# EAGLE board Glasses (EAGLE 9.1.0)
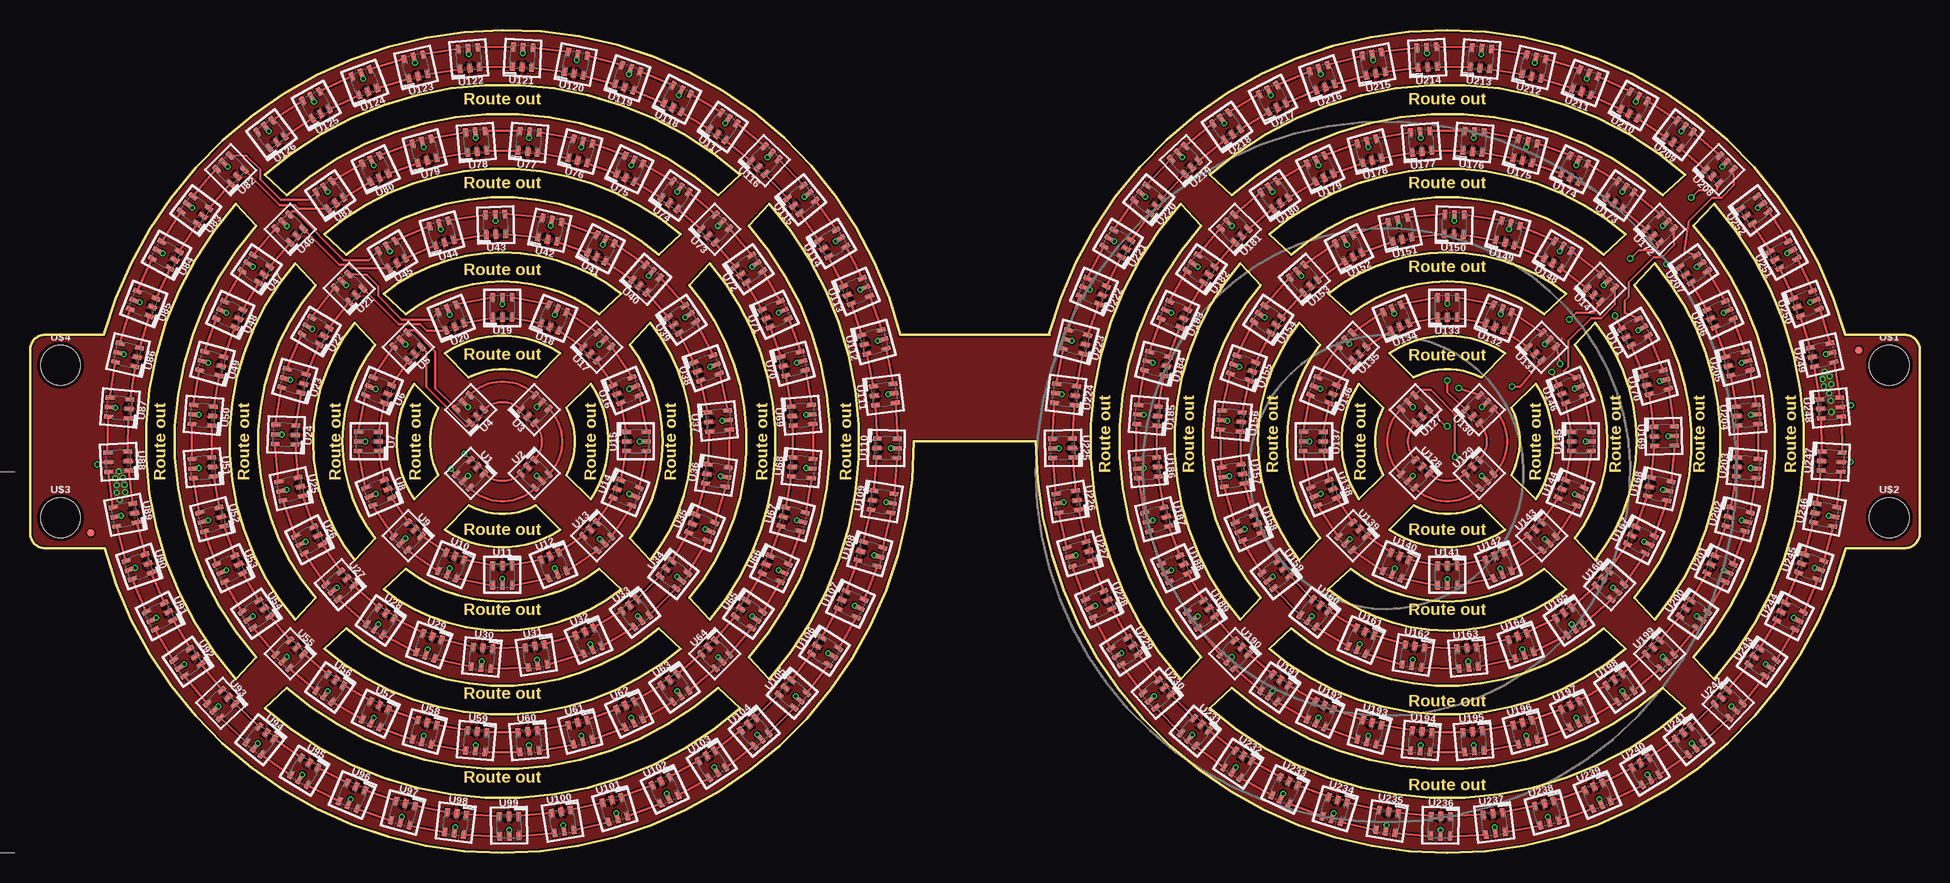
[diagram p9: board, top side]
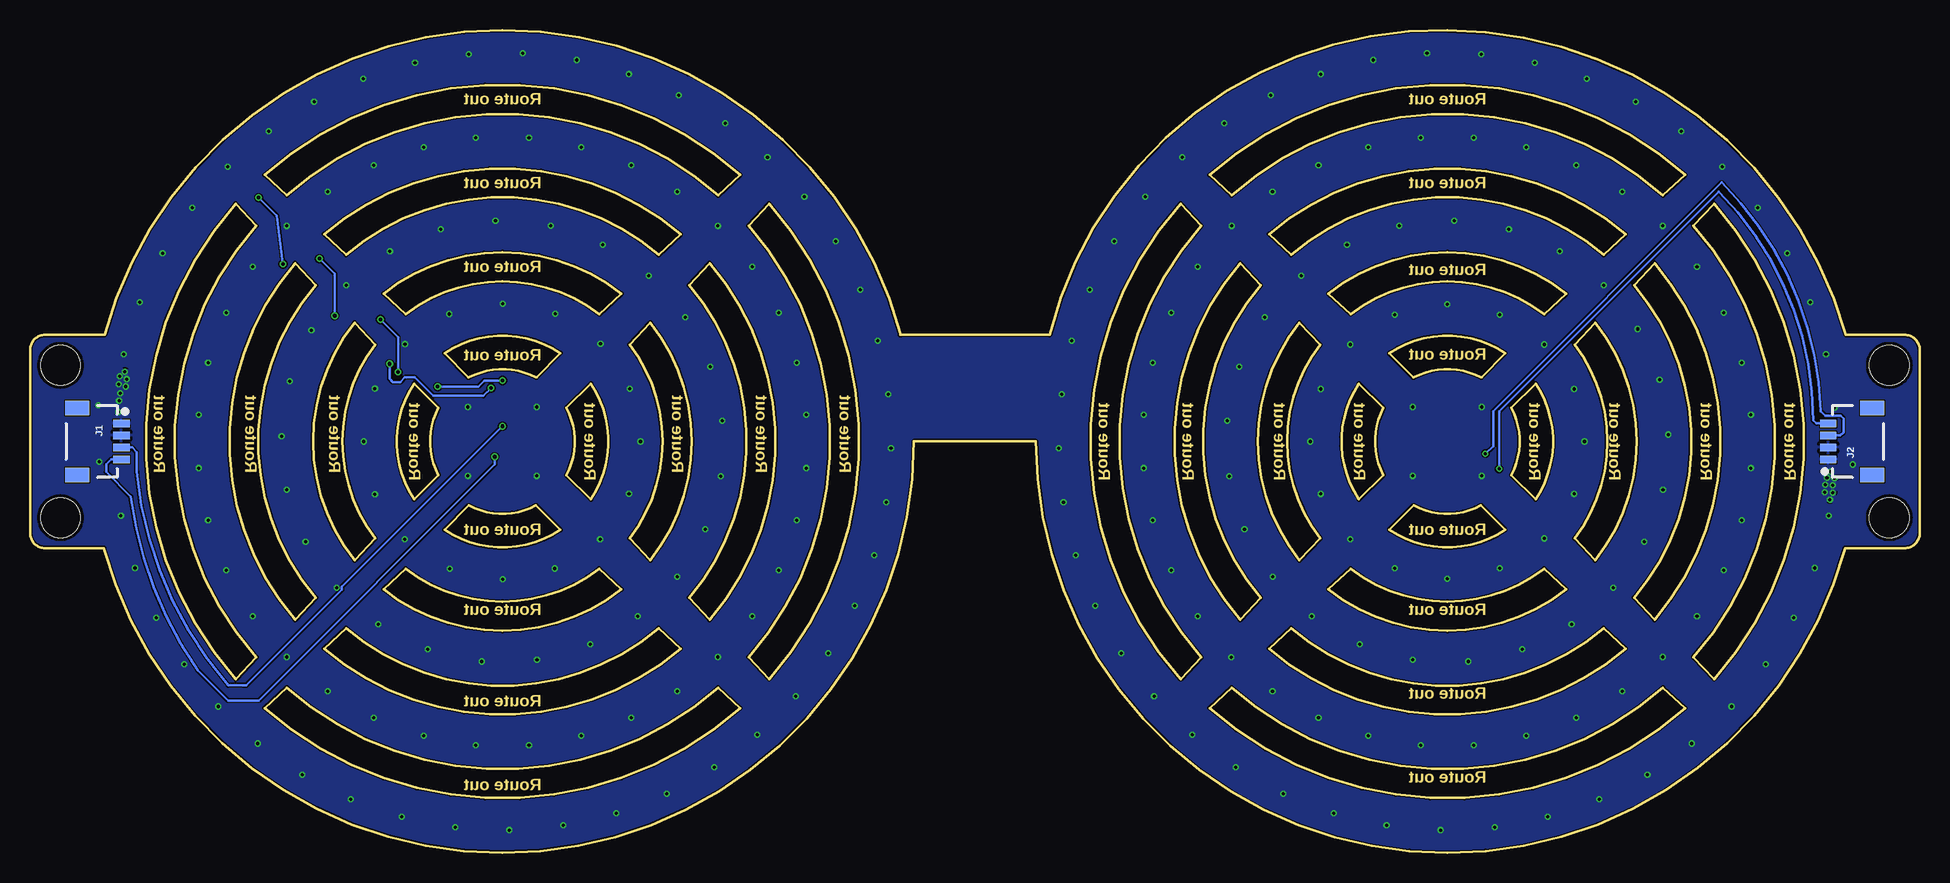
[diagram p10: board, bottom side, seen from below]

Size 157.48 x 68.58 mm. Coordinates in mm from the lower left corner, seen from the top.
Outline: 153 segments
Copper layers (1*16): Top 0.035mm / dielectric 1.5mm / Bottom 0.035mm
Design rules "SparkFun-2-layer-FAB-LIMIT": minimum track width 4mil, minimum drill 6mil, track to track 4mil, track to pad 4mil, pad to pad 4mil, via to via 4mil, smd to smd 4mil, copper to edge 4mil, drill to drill 4mil, minimum pad ring 5mil, minimum via ring 5mil, stop-mask expansion 4mil, vias tented up to drill 25mil, thermal gap 10mil

## Footprints (pad centres in the part's own frame; a part is rotated, then mirrored left to right if it is on the bottom)
FIDUCIAL-MICRO = smd 0.635 x 0.635: 1 0,0
1X04_1MM_RA = smd 0.6 x 1.35: 1 -1.5,0; 2 -0.5,0; 3 0.5,0; 4 1.5,0 | smd 1.2 x 2: NC1 2.8,-3.675; NC2 -2.8,-3.675
APA102-2020 = smd 0.4 x 0.7: CKI -0.8,-0.85; CKO 0.8,-0.85; GND 0,0.85; SDI -0.8,0.85; SDO 0.8,0.85; VDD 0,-0.85
STAND-OFF = hole 3.302: 0,0

## Placement (x,y rotation side)
FD1  FIDUCIALUFIDUCIAL  [FIDUCIAL-MICRO]  152.4,41.91 0 top
FD2  FIDUCIALUFIDUCIAL  [FIDUCIAL-MICRO]  5.08,26.67 0 top
J1  [1X04_1MM_RA]  149.86,34.29 270 bottom
J2  [1X04_1MM_RA]  7.62,34.29 90 bottom
U1  APA102-2020  [APA102-2020]  36.68,31.6 315 top
U2  APA102-2020  [APA102-2020]  42.06,31.6 45 top
U3  APA102-2020  [APA102-2020]  42.06,36.98 135 top
U4  APA102-2020  [APA102-2020]  36.68,36.98 225 top
U5  APA102-2020  [APA102-2020]  31.47,42.19 225 top
U6  APA102-2020  [APA102-2020]  29.04,38.57 247.5 top
U7  APA102-2020  [APA102-2020]  28.19,34.29 270 top
U8  APA102-2020  [APA102-2020]  29.04,30.01 292.5 top
U9  APA102-2020  [APA102-2020]  31.47,26.39 315 top
U10  APA102-2020  [APA102-2020]  35.09,23.96 337.5 top
U11  APA102-2020  [APA102-2020]  39.37,23.11 0 top
U12  APA102-2020  [APA102-2020]  43.65,23.96 22.5 top
U13  APA102-2020  [APA102-2020]  47.27,26.39 45 top
U14  APA102-2020  [APA102-2020]  49.7,30.01 67.5 top
U15  APA102-2020  [APA102-2020]  50.55,34.29 90 top
U16  APA102-2020  [APA102-2020]  49.7,38.57 112.5 top
U17  APA102-2020  [APA102-2020]  47.27,42.19 135 top
U18  APA102-2020  [APA102-2020]  43.65,44.62 157.5 top
U19  APA102-2020  [APA102-2020]  39.37,45.47 180 top
U20  APA102-2020  [APA102-2020]  35.09,44.62 202.5 top
U21  APA102-2020  [APA102-2020]  26.57,47.09 225 top
U22  APA102-2020  [APA102-2020]  23.79,43.5 239.4 top
U23  APA102-2020  [APA102-2020]  21.99,39.34 253.8 top
U24  APA102-2020  [APA102-2020]  21.28,34.86 268.2 top
U25  APA102-2020  [APA102-2020]  21.71,30.34 282.6 top
U26  APA102-2020  [APA102-2020]  23.25,26.07 297 top
U27  APA102-2020  [APA102-2020]  25.79,22.32 311.4 top
U28  APA102-2020  [APA102-2020]  29.2,19.32 325.8 top
U29  APA102-2020  [APA102-2020]  33.24,17.26 340.2 top
U30  APA102-2020  [APA102-2020]  37.67,16.27 354.6 top
U31  APA102-2020  [APA102-2020]  42.2,16.42 9 top
U32  APA102-2020  [APA102-2020]  46.56,17.68 23.4 top
U33  APA102-2020  [APA102-2020]  50.46,19.99 37.8 top
U34  APA102-2020  [APA102-2020]  53.67,23.2 52.2 top
U35  APA102-2020  [APA102-2020]  55.98,27.1 66.6 top
U36  APA102-2020  [APA102-2020]  57.24,31.46 81 top
U37  APA102-2020  [APA102-2020]  57.39,35.99 95.4 top
U38  APA102-2020  [APA102-2020]  56.4,40.42 109.8 top
U39  APA102-2020  [APA102-2020]  54.34,44.46 124.2 top
U40  APA102-2020  [APA102-2020]  51.34,47.87 138.6 top
U41  APA102-2020  [APA102-2020]  47.59,50.41 153 top
U42  APA102-2020  [APA102-2020]  43.32,51.95 167.4 top
U43  APA102-2020  [APA102-2020]  38.8,52.38 181.8 top
U44  APA102-2020  [APA102-2020]  34.32,51.67 196.2 top
U45  APA102-2020  [APA102-2020]  30.16,49.87 210.6 top
U46  APA102-2020  [APA102-2020]  21.63,52.03 225 top
U47  APA102-2020  [APA102-2020]  18.82,48.68 235 top
U48  APA102-2020  [APA102-2020]  16.64,44.89 245 top
U49  APA102-2020  [APA102-2020]  15.14,40.78 255 top
U50  APA102-2020  [APA102-2020]  14.38,36.48 265 top
U51  APA102-2020  [APA102-2020]  14.38,32.1 275 top
U52  APA102-2020  [APA102-2020]  15.14,27.8 285 top
U53  APA102-2020  [APA102-2020]  16.64,23.69 295 top
U54  APA102-2020  [APA102-2020]  18.82,19.9 305 top
U55  APA102-2020  [APA102-2020]  21.63,16.55 315 top
U56  APA102-2020  [APA102-2020]  24.98,13.74 325 top
U57  APA102-2020  [APA102-2020]  28.77,11.56 335 top
U58  APA102-2020  [APA102-2020]  32.88,10.06 345 top
U59  APA102-2020  [APA102-2020]  37.18,9.3 355 top
U60  APA102-2020  [APA102-2020]  41.56,9.3 5 top
U61  APA102-2020  [APA102-2020]  45.86,10.06 15 top
U62  APA102-2020  [APA102-2020]  49.97,11.56 25 top
U63  APA102-2020  [APA102-2020]  53.76,13.74 35 top
U64  APA102-2020  [APA102-2020]  57.11,16.55 45 top
U65  APA102-2020  [APA102-2020]  59.92,19.9 55 top
U66  APA102-2020  [APA102-2020]  62.1,23.69 65 top
U67  APA102-2020  [APA102-2020]  63.6,27.8 75 top
U68  APA102-2020  [APA102-2020]  64.36,32.1 85 top
U69  APA102-2020  [APA102-2020]  64.36,36.48 95 top
U70  APA102-2020  [APA102-2020]  63.6,40.78 105 top
U71  APA102-2020  [APA102-2020]  62.1,44.89 115 top
U72  APA102-2020  [APA102-2020]  59.92,48.68 125 top
U73  APA102-2020  [APA102-2020]  57.11,52.03 135 top
U74  APA102-2020  [APA102-2020]  53.76,54.84 145 top
U75  APA102-2020  [APA102-2020]  49.97,57.02 155 top
U76  APA102-2020  [APA102-2020]  45.86,58.52 165 top
U77  APA102-2020  [APA102-2020]  41.56,59.28 175 top
U78  APA102-2020  [APA102-2020]  37.18,59.28 185 top
U79  APA102-2020  [APA102-2020]  32.88,58.52 195 top
U80  APA102-2020  [APA102-2020]  28.77,57.02 205 top
U81  APA102-2020  [APA102-2020]  24.98,54.84 215 top
U82  APA102-2020  [APA102-2020]  16.69,56.97 225 top
U83  APA102-2020  [APA102-2020]  13.76,53.59 233 top
U84  APA102-2020  [APA102-2020]  11.32,49.84 241 top
U85  APA102-2020  [APA102-2020]  9.43,45.78 249 top
U86  APA102-2020  [APA102-2020]  8.12,41.5 257 top
U87  APA102-2020  [APA102-2020]  7.42,37.08 265 top
U88  APA102-2020  [APA102-2020]  7.35,32.61 273 top
U89  APA102-2020  [APA102-2020]  7.89,28.17 281 top
U90  APA102-2020  [APA102-2020]  9.05,23.85 289 top
U91  APA102-2020  [APA102-2020]  10.8,19.73 297 top
U92  APA102-2020  [APA102-2020]  13.1,15.9 305 top
U93  APA102-2020  [APA102-2020]  15.92,12.42 313 top
U94  APA102-2020  [APA102-2020]  19.19,9.37 321 top
U95  APA102-2020  [APA102-2020]  22.85,6.8 329 top
U96  APA102-2020  [APA102-2020]  26.84,4.77 337 top
U97  APA102-2020  [APA102-2020]  31.07,3.32 345 top
U98  APA102-2020  [APA102-2020]  35.46,2.46 353 top
U99  APA102-2020  [APA102-2020]  39.93,2.23 1 top
U100  APA102-2020  [APA102-2020]  44.39,2.62 9 top
U101  APA102-2020  [APA102-2020]  48.75,3.62 17 top
U102  APA102-2020  [APA102-2020]  52.92,5.23 25 top
U103  APA102-2020  [APA102-2020]  56.84,7.4 33 top
U104  APA102-2020  [APA102-2020]  60.41,10.09 41 top
U105  APA102-2020  [APA102-2020]  63.57,13.25 49 top
U106  APA102-2020  [APA102-2020]  66.26,16.82 57 top
U107  APA102-2020  [APA102-2020]  68.43,20.74 65 top
U108  APA102-2020  [APA102-2020]  70.04,24.91 73 top
U109  APA102-2020  [APA102-2020]  71.04,29.27 81 top
U110  APA102-2020  [APA102-2020]  71.43,33.73 89 top
U111  APA102-2020  [APA102-2020]  71.2,38.2 97 top
U112  APA102-2020  [APA102-2020]  70.34,42.59 105 top
U113  APA102-2020  [APA102-2020]  68.89,46.82 113 top
U114  APA102-2020  [APA102-2020]  66.86,50.81 121 top
U115  APA102-2020  [APA102-2020]  64.29,54.47 129 top
U116  APA102-2020  [APA102-2020]  61.24,57.74 137 top
U117  APA102-2020  [APA102-2020]  57.76,60.56 145 top
U118  APA102-2020  [APA102-2020]  53.93,62.86 153 top
U119  APA102-2020  [APA102-2020]  49.81,64.61 161 top
U120  APA102-2020  [APA102-2020]  45.49,65.77 169 top
U121  APA102-2020  [APA102-2020]  41.05,66.31 177 top
U122  APA102-2020  [APA102-2020]  36.58,66.24 185 top
U123  APA102-2020  [APA102-2020]  32.16,65.54 193 top
U124  APA102-2020  [APA102-2020]  27.88,64.23 201 top
U125  APA102-2020  [APA102-2020]  23.82,62.34 209 top
U126  APA102-2020  [APA102-2020]  20.07,59.9 217 top
U127  APA102-2020  [APA102-2020]  115.42,36.98 225 top
U128  APA102-2020  [APA102-2020]  115.42,31.6 315 top
U129  APA102-2020  [APA102-2020]  120.8,31.6 45 top
U130  APA102-2020  [APA102-2020]  120.8,36.98 135 top
U131  APA102-2020  [APA102-2020]  126.01,42.19 135 top
U132  APA102-2020  [APA102-2020]  122.39,44.62 157.5 top
U133  APA102-2020  [APA102-2020]  118.11,45.47 180 top
U134  APA102-2020  [APA102-2020]  113.83,44.62 202.5 top
U135  APA102-2020  [APA102-2020]  110.21,42.19 225 top
U136  APA102-2020  [APA102-2020]  107.78,38.57 247.5 top
U137  APA102-2020  [APA102-2020]  106.93,34.29 270 top
U138  APA102-2020  [APA102-2020]  107.78,30.01 292.5 top
U139  APA102-2020  [APA102-2020]  110.21,26.39 315 top
U140  APA102-2020  [APA102-2020]  113.83,23.96 337.5 top
U141  APA102-2020  [APA102-2020]  118.11,23.11 0 top
U142  APA102-2020  [APA102-2020]  122.39,23.96 22.5 top
U143  APA102-2020  [APA102-2020]  126.01,26.39 45 top
U144  APA102-2020  [APA102-2020]  128.44,30.01 67.5 top
U145  APA102-2020  [APA102-2020]  129.29,34.29 90 top
U146  APA102-2020  [APA102-2020]  128.44,38.57 112.5 top
U147  APA102-2020  [APA102-2020]  130.91,47.09 135 top
U148  APA102-2020  [APA102-2020]  127.32,49.87 149.4 top
U149  APA102-2020  [APA102-2020]  123.16,51.67 163.8 top
U150  APA102-2020  [APA102-2020]  118.68,52.38 178.2 top
U151  APA102-2020  [APA102-2020]  114.16,51.95 192.6 top
U152  APA102-2020  [APA102-2020]  109.89,50.41 207 top
U153  APA102-2020  [APA102-2020]  106.14,47.87 221.4 top
U154  APA102-2020  [APA102-2020]  103.14,44.46 235.8 top
U155  APA102-2020  [APA102-2020]  101.08,40.42 250.2 top
U156  APA102-2020  [APA102-2020]  100.09,35.99 264.6 top
U157  APA102-2020  [APA102-2020]  100.24,31.46 279 top
U158  APA102-2020  [APA102-2020]  101.5,27.1 293.4 top
U159  APA102-2020  [APA102-2020]  103.81,23.2 307.8 top
U160  APA102-2020  [APA102-2020]  107.02,19.99 322.2 top
U161  APA102-2020  [APA102-2020]  110.92,17.68 336.6 top
U162  APA102-2020  [APA102-2020]  115.28,16.42 351 top
U163  APA102-2020  [APA102-2020]  119.81,16.27 5.4 top
U164  APA102-2020  [APA102-2020]  124.24,17.26 19.8 top
U165  APA102-2020  [APA102-2020]  128.28,19.32 34.2 top
U166  APA102-2020  [APA102-2020]  131.69,22.32 48.6 top
U167  APA102-2020  [APA102-2020]  134.23,26.07 63 top
U168  APA102-2020  [APA102-2020]  135.77,30.34 77.4 top
U169  APA102-2020  [APA102-2020]  136.2,34.73 91.4 top
U170  APA102-2020  [APA102-2020]  135.52,39.22 105.8 top
U171  APA102-2020  [APA102-2020]  133.75,43.39 120.2 top
U172  APA102-2020  [APA102-2020]  135.85,52.03 135 top
U173  APA102-2020  [APA102-2020]  132.5,54.84 145 top
U174  APA102-2020  [APA102-2020]  128.71,57.02 155 top
U175  APA102-2020  [APA102-2020]  124.6,58.52 165 top
U176  APA102-2020  [APA102-2020]  120.3,59.28 175 top
U177  APA102-2020  [APA102-2020]  115.92,59.28 185 top
U178  APA102-2020  [APA102-2020]  111.62,58.52 195 top
U179  APA102-2020  [APA102-2020]  107.51,57.02 205 top
U180  APA102-2020  [APA102-2020]  103.72,54.84 215 top
U181  APA102-2020  [APA102-2020]  100.37,52.03 225 top
U182  APA102-2020  [APA102-2020]  97.56,48.68 235 top
U183  APA102-2020  [APA102-2020]  95.38,44.89 245 top
U184  APA102-2020  [APA102-2020]  93.88,40.78 255 top
U185  APA102-2020  [APA102-2020]  93.12,36.48 265 top
U186  APA102-2020  [APA102-2020]  93.12,32.1 275 top
U187  APA102-2020  [APA102-2020]  93.88,27.8 285 top
U188  APA102-2020  [APA102-2020]  95.38,23.69 295 top
U189  APA102-2020  [APA102-2020]  97.56,19.9 305 top
U190  APA102-2020  [APA102-2020]  100.37,16.55 315 top
U191  APA102-2020  [APA102-2020]  103.72,13.74 325 top
U192  APA102-2020  [APA102-2020]  107.51,11.56 335 top
U193  APA102-2020  [APA102-2020]  111.62,10.06 345 top
U194  APA102-2020  [APA102-2020]  115.92,9.3 355 top
U195  APA102-2020  [APA102-2020]  120.3,9.3 5 top
U196  APA102-2020  [APA102-2020]  124.6,10.06 15 top
U197  APA102-2020  [APA102-2020]  128.71,11.56 25 top
U198  APA102-2020  [APA102-2020]  132.5,13.74 35 top
U199  APA102-2020  [APA102-2020]  135.85,16.55 45 top
U200  APA102-2020  [APA102-2020]  138.66,19.9 55 top
U201  APA102-2020  [APA102-2020]  140.84,23.69 65 top
U202  APA102-2020  [APA102-2020]  142.34,27.8 75 top
U203  APA102-2020  [APA102-2020]  143.1,32.1 85 top
U204  APA102-2020  [APA102-2020]  143.1,36.48 95 top
U205  APA102-2020  [APA102-2020]  142.34,40.78 105 top
U206  APA102-2020  [APA102-2020]  140.84,44.89 115 top
U207  APA102-2020  [APA102-2020]  138.66,48.68 125 top
U208  APA102-2020  [APA102-2020]  140.79,56.97 135 top
U209  APA102-2020  [APA102-2020]  137.41,59.9 143 top
U210  APA102-2020  [APA102-2020]  133.66,62.34 151 top
U211  APA102-2020  [APA102-2020]  129.6,64.23 159 top
U212  APA102-2020  [APA102-2020]  125.32,65.54 167 top
U213  APA102-2020  [APA102-2020]  120.9,66.24 175 top
U214  APA102-2020  [APA102-2020]  116.43,66.31 183 top
U215  APA102-2020  [APA102-2020]  111.99,65.77 191 top
U216  APA102-2020  [APA102-2020]  107.67,64.61 199 top
U217  APA102-2020  [APA102-2020]  103.55,62.86 207 top
U218  APA102-2020  [APA102-2020]  99.72,60.56 215 top
U219  APA102-2020  [APA102-2020]  96.24,57.74 223 top
U220  APA102-2020  [APA102-2020]  93.19,54.47 231 top
U221  APA102-2020  [APA102-2020]  90.62,50.81 239 top
U222  APA102-2020  [APA102-2020]  88.59,46.82 247 top
U223  APA102-2020  [APA102-2020]  87.14,42.59 255 top
U224  APA102-2020  [APA102-2020]  86.28,38.2 263 top
U225  APA102-2020  [APA102-2020]  86.05,33.73 271 top
U226  APA102-2020  [APA102-2020]  86.44,29.27 279 top
U227  APA102-2020  [APA102-2020]  87.44,24.91 287 top
U228  APA102-2020  [APA102-2020]  89.05,20.74 295 top
U229  APA102-2020  [APA102-2020]  91.22,16.82 303 top
U230  APA102-2020  [APA102-2020]  93.91,13.25 311 top
U231  APA102-2020  [APA102-2020]  97.07,10.09 319 top
U232  APA102-2020  [APA102-2020]  100.64,7.4 327 top
U233  APA102-2020  [APA102-2020]  104.56,5.23 335 top
U234  APA102-2020  [APA102-2020]  108.73,3.62 343 top
U235  APA102-2020  [APA102-2020]  113.09,2.62 351 top
U236  APA102-2020  [APA102-2020]  117.55,2.23 359 top
U237  APA102-2020  [APA102-2020]  122.02,2.46 7 top
U238  APA102-2020  [APA102-2020]  126.41,3.32 15 top
U239  APA102-2020  [APA102-2020]  130.64,4.77 23 top
U240  APA102-2020  [APA102-2020]  134.63,6.8 31 top
U241  APA102-2020  [APA102-2020]  138.29,9.37 39 top
U242  APA102-2020  [APA102-2020]  141.56,12.42 47 top
U243  APA102-2020  [APA102-2020]  144.38,15.9 55 top
U244  APA102-2020  [APA102-2020]  146.68,19.73 63 top
U245  APA102-2020  [APA102-2020]  148.43,23.85 71 top
U246  APA102-2020  [APA102-2020]  149.59,28.17 79 top
U247  APA102-2020  [APA102-2020]  150.13,32.61 87 top
U248  APA102-2020  [APA102-2020]  150.06,37.08 95 top
U249  APA102-2020  [APA102-2020]  149.36,41.5 103 top
U250  APA102-2020  [APA102-2020]  148.05,45.78 111 top
U251  APA102-2020  [APA102-2020]  146.16,49.84 119 top
U252  APA102-2020  [APA102-2020]  143.72,53.59 127 top
U$1  [STAND-OFF]  154.94,40.64 0 top
U$2  [STAND-OFF]  154.94,27.94 0 top
U$3  [STAND-OFF]  2.54,27.94 0 top
U$4  [STAND-OFF]  2.54,40.64 0 top

## Tracks (layer width: path | path; a pad name or v marks a point on that pad's centre or on a via)
CK1
  Top 0.203: U29.CKI U28.CKO
CK2
  Top 0.203: U57.CKI U56.CKO
CK3
  Top 0.203: U85.CKI U84.CKO
CK4
  Top 0.203: U113.CKI U112.CKO
CK5
  Top 0.203: U141.CKI U140.CKO
CK6
  Top 0.203: U168.CKO U169.CKI
CK7
  Top 0.203: U197.CKI U196.CKO
CK8
  Top 0.203: U225.CKI U224.CKO
GND  (via drill 0.25 pad 0.51)
  Top 0.203: 127.64,42.86 127.64,42.8
  other vias: 7.4,31.79 7.11,31.24 7.73,31.27 7.24,30.64 7.24,30.02 7.88,30.67 7.93,30.06 7.48,29.45 149.49,38.87 150.09,39.04 149.95,38.31 150.06,37.67 150.12,36.75 149.4,39.49 149.99,39.71 149.57,40.11
  pour Top: 114.3,34.29 arc90 118.11,30.48 arc270
  pour Bottom (isolate 0.305): 6.88,33.05 6.87,31.21 7.16,29.2 8.34,29.41 8.36,33.11 6.9,33.06
  pour Bottom (isolate 0.305): 150.69,35.45 150.7,37.29 150.25,40.45 149.02,40.23 148.99,35.38 150.67,35.44
  pour Top: 0,0 0,69.85 157.48,69.85 157.48,0
N$1
  Top 0.203: U1.SDO arc90 U2.SDI
N$2
  Top 0.203: U1.CKO arc90 U2.CKI
N$3
  Top 0.203: U2.CKO arc90 U3.CKI
N$4
  Top 0.203: U2.SDO arc90 U3.SDI
N$5
  Top 0.203: U3.SDO arc90 U4.SDI
N$6
  Top 0.203: U3.CKO arc90 U4.CKI
N$7
  Top 0.203: U4.CKO 33.78,38.75 33.78,41.78 32,43.56 31.63,43.56 U5.CKI
N$8
  Top 0.203: U5.SDI 33.02,41.77 33.02,38.86 36.32,35.56 36.45,35.56 U4.SDO
N$9
  Top 0.203: U6.CKI U5.CKO
N$10
  Top 0.203: U6.SDI U5.SDO
N$11
  Top 0.203: U7.CKI U6.CKO
N$12
  Top 0.203: U7.SDI U6.SDO
N$13
  Top 0.203: U9.SDI U8.SDO
N$14
  Top 0.203: U9.CKI U8.CKO
N$15
  Top 0.203: U10.CKI U9.CKO
N$16
  Top 0.203: U9.SDO U10.SDI
N$17
  Top 0.203: U11.SDI U10.SDO
N$18
  Top 0.203: U11.CKI U10.CKO
N$19
  Top 0.203: U12.CKI U11.CKO
N$20
  Top 0.203: U12.SDI U11.SDO
N$21
  Top 0.203: U13.CKI U12.CKO
N$22
  Top 0.203: U13.SDI U12.SDO
N$23
  Top 0.203: U14.CKI U13.CKO
N$24
  Top 0.203: U14.SDI U13.SDO
N$25
  Top 0.203: U8.SDI U7.SDO
N$26
  Top 0.203: U8.CKI U7.CKO
N$27
  Top 0.203: U16.SDI U15.SDO
N$28
  Top 0.203: U16.CKI U15.CKO
N$29
  Top 0.203: U17.CKI U16.CKO
N$30
  Top 0.203: U17.SDI U16.SDO
N$31
  Top 0.203: U18.SDI U17.SDO
N$32
  Top 0.203: U18.CKI U17.CKO
N$33
  Top 0.203: U19.CKI U18.CKO
N$34
  Top 0.203: U19.SDI U18.SDO
N$35
  Top 0.203: U20.CKI U19.CKO
N$36
  Top 0.203: U20.SDI U19.SDO
N$37
  Top 0.203: U21.CKI 27.68,48.2 28.07,48.2 29.02,47.24 29.02,46.42 30.99,44.45 33.38,44.45 U20.CKO
N$38
  Top 0.203: U20.SDO 33.06,43.52 32.51,44.07 30.72,44.07 U21.SDI
N$39
  Top 0.203: U23.SDI U22.SDO
N$40
  Top 0.203: U23.CKI U22.CKO
N$41
  Top 0.203: U24.CKI U23.CKO
N$42
  Top 0.203: U24.SDI U23.SDO
N$43
  Top 0.203: U25.SDI U24.SDO
N$44
  Top 0.203: U25.CKI U24.CKO
N$45
  Top 0.203: U26.CKI U25.CKO
N$46
  Top 0.203: U26.SDI U25.SDO
N$47
  Top 0.203: U27.CKI U26.CKO
N$48
  Top 0.203: U27.SDI U26.SDO
N$49
  Top 0.203: U28.CKI U27.CKO
N$50
  Top 0.203: U28.SDI U27.SDO
N$51
  Top 0.203: U22.SDI U21.SDO
N$52
  Top 0.203: U22.CKI U21.CKO
N$53
  Top 0.203: U15.SDI U14.SDO
N$54
  Top 0.203: U15.CKI U14.CKO
N$55
  Top 0.203: U30.SDI U29.SDO
N$56
  Top 0.203: U30.CKI U29.CKO
N$57
  Top 0.203: U31.CKI U30.CKO
N$58
  Top 0.203: U31.SDI U30.SDO
N$59
  Top 0.203: U32.SDI U31.SDO
N$60
  Top 0.203: U32.CKI U31.CKO
N$61
  Top 0.203: U33.CKI U32.CKO
N$62
  Top 0.203: U33.SDI U32.SDO
N$63
  Top 0.203: U34.CKI U33.CKO
N$64
  Top 0.203: U34.SDI U33.SDO
N$65
  Top 0.203: U35.CKI U34.CKO
N$66
  Top 0.203: U35.SDI U34.SDO
N$67
  Top 0.203: U37.SDI U36.SDO
N$68
  Top 0.203: U37.CKI U36.CKO
N$69
  Top 0.203: U38.CKI U37.CKO
N$70
  Top 0.203: U38.SDI U37.SDO
N$71
  Top 0.203: U39.SDI U38.SDO
N$72
  Top 0.203: U39.CKI U38.CKO
N$73
  Top 0.203: U40.CKI U39.CKO
N$74
  Top 0.203: U40.SDI U39.SDO
N$75
  Top 0.203: U41.CKI U40.CKO
N$76
  Top 0.203: U41.SDI U40.SDO
N$77
  Top 0.203: U42.CKI U41.CKO
N$78
  Top 0.203: U42.SDI U41.SDO
N$79
  Top 0.203: U36.SDI U35.SDO
N$80
  Top 0.203: U36.CKI U35.CKO
N$81
  Top 0.203: U44.SDI U43.SDO
N$82
  Top 0.203: U44.CKI U43.CKO
N$83
  Top 0.203: U45.CKI U44.CKO
N$84
  Top 0.203: U45.SDI U44.SDO
N$85
  Top 0.203: U45.SDO 26.84,48.73 26.54,49.02 25.77,49.02 U46.SDI
N$86
  Top 0.203: U45.CKO 28.25,49.4 26.16,49.4 22.1,53.47 21.87,53.47 U46.CKI
N$87
  Top 0.203: U47.CKI U46.CKO
N$88
  Top 0.203: U47.SDI U46.SDO
N$89
  Top 0.203: U48.CKI U47.CKO
N$90
  Top 0.203: U48.SDI U47.SDO
N$91
  Top 0.203: U49.CKI U48.CKO
N$92
  Top 0.203: U49.SDI U48.SDO
N$93
  Top 0.203: U51.SDI U50.SDO
N$94
  Top 0.203: U51.CKI U50.CKO
N$95
  Top 0.203: U52.CKI U51.CKO
N$96
  Top 0.203: U52.SDI U51.SDO
N$97
  Top 0.203: U53.SDI U52.SDO
N$98
  Top 0.203: U53.CKI U52.CKO
N$99
  Top 0.203: U54.CKI U53.CKO
N$100
  Top 0.203: U54.SDI U53.SDO
N$101
  Top 0.203: U55.CKI U54.CKO
N$102
  Top 0.203: U55.SDI U54.SDO
N$103
  Top 0.203: U56.CKI U55.CKO
N$104
  Top 0.203: U56.SDI U55.SDO
N$105
  Top 0.203: U50.SDI U49.SDO
N$106
  Top 0.203: U50.CKI U49.CKO
N$107
  Top 0.203: U43.SDI U42.SDO
N$108
  Top 0.203: U43.CKI U42.CKO
N$109
  Top 0.203: U58.SDI U57.SDO
N$110
  Top 0.203: U58.CKI U57.CKO
N$111
  Top 0.203: U59.CKI U58.CKO
N$112
  Top 0.203: U59.SDI U58.SDO
N$113
  Top 0.203: U60.SDI U59.SDO
N$114
  Top 0.203: U60.CKI U59.CKO
N$115
  Top 0.203: U61.CKI U60.CKO
N$116
  Top 0.203: U61.SDI U60.SDO
N$117
  Top 0.203: U62.CKI U61.CKO
N$118
  Top 0.203: U62.SDI U61.SDO
N$119
  Top 0.203: U63.CKI U62.CKO
N$120
  Top 0.203: U63.SDI U62.SDO
N$121
  Top 0.203: U65.SDI U64.SDO
N$122
  Top 0.203: U65.CKI U64.CKO
N$123
  Top 0.203: U66.CKI U65.CKO
N$124
  Top 0.203: U66.SDI U65.SDO
N$125
  Top 0.203: U67.SDI U66.SDO
N$126
  Top 0.203: U67.CKI U66.CKO
N$127
  Top 0.203: U68.CKI U67.CKO
N$128
  Top 0.203: U68.SDI U67.SDO
N$129
  Top 0.203: U69.CKI U68.CKO
N$130
  Top 0.203: U69.SDI U68.SDO
N$131
  Top 0.203: U70.CKI U69.CKO
N$132
  Top 0.203: U70.SDI U69.SDO
N$133
  Top 0.203: U63.SDO U64.SDI
N$134
  Top 0.203: U63.CKO U64.CKI
N$135
  Top 0.203: U72.SDI U71.SDO
N$136
  Top 0.203: U72.CKI U71.CKO
N$137
  Top 0.203: U73.CKI U72.CKO
N$138
  Top 0.203: U73.SDI U72.SDO
N$139
  Top 0.203: U74.SDI U73.SDO
N$140
  Top 0.203: U74.CKI U73.CKO
N$141
  Top 0.203: U75.CKI U74.CKO
N$142
  Top 0.203: U75.SDI U74.SDO
N$143
  Top 0.203: U76.CKI U75.CKO
N$144
  Top 0.203: U76.SDI U75.SDO
N$145
  Top 0.203: U77.CKI U76.CKO
N$146
  Top 0.203: U77.SDI U76.SDO
N$147
  Top 0.203: U79.SDI U78.SDO
N$148
  Top 0.203: U79.CKI U78.CKO
N$149
  Top 0.203: U80.CKI U79.CKO
N$150
  Top 0.203: U80.SDI U79.SDO
N$151
  Top 0.203: U81.SDI U80.SDO
N$152
  Top 0.203: U81.CKI U80.CKO
N$153
  Top 0.203: U82.CKI 17.83,58.1 18.03,58.1 19.18,56.96 19.18,56.13 20.89,54.42 23.19,54.42 U81.CKO
N$154
  Top 0.203: U81.SDO 22.39,53.68 22.1,53.98 20.83,53.98 17.87,56.93 U82.SDI
N$155
  Top 0.203: U83.CKI U82.CKO
N$156
  Top 0.203: U83.SDI U82.SDO
N$157
  Top 0.203: U84.CKI U83.CKO
N$158
  Top 0.203: U84.SDI U83.SDO
N$159
  Top 0.203: U78.SDI U77.SDO
N$160
  Top 0.203: U78.CKI U77.CKO
N$161
  Top 0.203: U71.SDI U70.SDO
N$162
  Top 0.203: U71.CKI U70.CKO
N$163
  Top 0.203: U86.SDI U85.SDO
N$164
  Top 0.203: U86.CKI U85.CKO
N$165
  Top 0.203: U87.CKI U86.CKO
N$166
  Top 0.203: U87.SDI U86.SDO
N$167
  Top 0.203: U88.SDI U87.SDO
N$168
  Top 0.203: U88.CKI U87.CKO
N$169
  Top 0.203: U89.CKI U88.CKO
N$170
  Top 0.203: U89.SDI U88.SDO
N$171
  Top 0.203: U90.CKI U89.CKO
N$172
  Top 0.203: U90.SDI U89.SDO
N$173
  Top 0.203: U91.CKI U90.CKO
N$174
  Top 0.203: U91.SDI U90.SDO
N$175
  Top 0.203: U93.SDI U92.SDO
N$176
  Top 0.203: U93.CKI U92.CKO
N$177
  Top 0.203: U94.CKI U93.CKO
N$178
  Top 0.203: U94.SDI U93.SDO
N$179
  Top 0.203: U95.SDI U94.SDO
N$180
  Top 0.203: U95.CKI U94.CKO
N$181
  Top 0.203: U96.SDI U95.SDO
N$182
  Top 0.203: U96.CKI U95.CKO
N$183
  Top 0.203: U97.CKI U96.CKO
N$184
  Top 0.203: U97.SDI U96.SDO
N$185
  Top 0.203: U98.CKI U97.CKO
N$186
  Top 0.203: U98.SDI U97.SDO
N$187
  Top 0.203: U92.SDI U91.SDO
N$188
  Top 0.203: U92.CKI U91.CKO
N$189
  Top 0.203: U100.SDI U99.SDO
N$190
  Top 0.203: U100.CKI U99.CKO
N$191
  Top 0.203: U101.CKI U100.CKO
N$192
  Top 0.203: U101.SDI U100.SDO
N$193
  Top 0.203: U102.SDI U101.SDO
N$194
  Top 0.203: U102.CKI U101.CKO
N$195
  Top 0.203: U103.CKI U102.CKO
N$196
  Top 0.203: U103.SDI U102.SDO
N$197
  Top 0.203: U104.CKI U103.CKO
N$198
  Top 0.203: U104.SDI U103.SDO
N$199
  Top 0.203: U105.CKI U104.CKO
N$200
  Top 0.203: U105.SDI U104.SDO
N$201
  Top 0.203: U107.SDI U106.SDO
N$202
  Top 0.203: U107.CKI U106.CKO
N$203
  Top 0.203: U108.CKI U107.CKO
N$204
  Top 0.203: U108.SDI U107.SDO
N$205
  Top 0.203: U109.SDI U108.SDO
N$206
  Top 0.203: U109.CKI U108.CKO
N$207
  Top 0.203: U110.CKI U109.CKO
N$208
  Top 0.203: U110.SDI U109.SDO
N$209
  Top 0.203: U111.CKI U110.CKO
N$210
  Top 0.203: U111.SDI U110.SDO
N$211
  Top 0.203: U112.CKI U111.CKO
N$212
  Top 0.203: U112.SDI U111.SDO
N$213
  Top 0.203: U106.SDI U105.SDO
N$214
  Top 0.203: U106.CKI U105.CKO
N$215
  Top 0.203: U99.SDI U98.SDO
N$216
  Top 0.203: U99.CKI U98.CKO
N$217
  Top 0.203: U114.SDI U113.SDO
N$218
  Top 0.203: U114.CKI U113.CKO
N$219
  Top 0.203: U115.CKI U114.CKO
N$220
  Top 0.203: U115.SDI U114.SDO
N$221
  Top 0.203: U116.SDI U115.SDO
N$222
  Top 0.203: U116.CKI U115.CKO
N$223
  Top 0.203: U117.CKI U116.CKO
N$224
  Top 0.203: U117.SDI U116.SDO
N$225
  Top 0.203: U118.CKI U117.CKO
N$226
  Top 0.203: U118.SDI U117.SDO
N$227
  Top 0.203: U119.CKI U118.CKO
N$228
  Top 0.203: U119.SDI U118.SDO
N$229
  Top 0.203: U121.SDI U120.SDO
N$230
  Top 0.203: U121.CKI U120.CKO
N$231
  Top 0.203: U122.CKI U121.CKO
N$232
  Top 0.203: U122.SDI U121.SDO
N$233
  Top 0.203: U123.SDI U122.SDO
N$234
  Top 0.203: U123.CKI U122.CKO
N$235
  Top 0.203: U124.CKI U123.CKO
N$236
  Top 0.203: U124.SDI U123.SDO
N$237
  Top 0.203: U125.CKI U124.CKO
N$238
  Top 0.203: U125.SDI U124.SDO
N$239
  Top 0.203: U126.CKI U125.CKO
N$240
  Top 0.203: U126.SDI U125.SDO
N$241
  Top 0.203: U120.SDI U119.SDO
N$242
  Top 0.203: U120.CKI U119.CKO
N$243
  Top 0.203: U127.SDO arc90 U128.SDI
N$244
  Top 0.203: U127.CKO arc90 U128.CKI
N$245
  Top 0.203: U128.CKO arc90 U129.CKI
N$246
  Top 0.203: U128.SDO arc90 U129.SDI
N$247
  Top 0.203: U129.SDO arc90 U130.SDI
N$248
  Top 0.203: U129.CKO arc90 U130.CKI
N$249  (via drill 0.3)
  Top 0.203: U131.CKI v127.51,40.77 | U130.CKO v119.06,38.73
  Bottom 0.203: v119.06,38.73 119.7,38.1 123.89,38.1 125.41,39.62 126.24,39.62 126.62,39.24 127.25,39.24 127.51,39.5 v127.51,40.77
N$250  (via drill 0.3)
  Top 0.203: U130.SDO 118.11,38.41 v118.11,39.37 | v123.51,38.86 124.17,38.86 U131.SDI
  Bottom 0.203: v118.11,39.37 119.63,39.37 120.14,38.86 v123.51,38.86
N$251
  Top 0.203: U132.CKI U131.CKO
N$252
  Top 0.203: U132.SDI U131.SDO
N$253
  Top 0.203: U133.CKI U132.CKO
N$254
  Top 0.203: U133.SDI U132.SDO
N$255
  Top 0.203: U135.SDI U134.SDO
N$256
  Top 0.203: U135.CKI U134.CKO
N$257
  Top 0.203: U136.CKI U135.CKO
N$258
  Top 0.203: U136.SDI U135.SDO
N$259
  Top 0.203: U137.SDI U136.SDO
N$260
  Top 0.203: U137.CKI U136.CKO
N$261
  Top 0.203: U138.CKI U137.CKO
N$262
  Top 0.203: U138.SDI U137.SDO
N$263
  Top 0.203: U139.CKI U138.CKO
N$264
  Top 0.203: U139.SDI U138.SDO
N$265
  Top 0.203: U140.CKI U139.CKO
N$266
  Top 0.203: U140.SDI U139.SDO
N$267
  Top 0.203: U133.SDO U134.SDI
N$268
  Top 0.203: U134.CKI U133.CKO
N$269  (via drill 0.3)
  Top 0.203: U127.SDI 117.97,35.56 v118.11,35.56
  Bottom 0.203: J1.3 148.98,33.79 148.59,33.4 148.59,31.81 arc87 148.59,31.75 arc-35 140.97,13.97 139.7,13.97 139.46,13.97 131.49,21.93 131.49,22.18 v118.11,35.56
N$270  (via drill 0.25 pad 0.51)
  Top 0.203: U1.SDI v36.2,33.27
  Bottom 0.203: v36.2,33.27 35.56,33.91 35.56,36.83 16.51,55.88 arc43 8.25,36.83 7.87,36.45 6.6,36.45 6.35,36.2 6.35,35.05 6.61,34.79 J2.3
N$271
  Top 0.203: U142.SDI U141.SDO
N$272
  Top 0.203: U142.CKI U141.CKO
N$273
  Top 0.203: U143.CKI U142.CKO
N$274
  Top 0.203: U143.SDI U142.SDO
N$275
  Top 0.203: U144.SDI U143.SDO
N$276
  Top 0.203: U144.CKI U143.CKO
N$277
  Top 0.203: U145.CKI U144.CKO
N$278
  Top 0.203: U145.SDI U144.SDO
N$279
  Top 0.203: U146.CKI U145.CKO
N$280
  Top 0.203: U146.SDI U145.SDO
N$281
  Top 0.203: U147.CKI 132.08,46.09 132.08,45.72 130.94,44.58 130.11,44.58 128.21,42.67 128.21,40.51 127.83,40.13 U146.CKO
N$282  (via drill 0.3)
  Top 0.203: v128.27,44.45 128.84,45.02 130.33,45.02 U147.SDI | U146.SDO v126.81,40.07
  Bottom 0.203: v128.27,44.45 126.81,42.99 v126.81,40.07
N$283
  Top 0.203: U149.SDI U148.SDO
N$284
  Top 0.203: U149.CKI U148.CKO
N$285
  Top 0.203: U150.CKI U149.CKO
N$286
  Top 0.203: U150.SDI U149.SDO
N$287
  Top 0.203: U151.SDI U150.SDO
N$288
  Top 0.203: U151.CKI U150.CKO
N$289
  Top 0.203: U152.CKI U151.CKO
N$290
  Top 0.203: U152.SDI U151.SDO
N$291
  Top 0.203: U153.CKI U152.CKO
N$292
  Top 0.203: U153.SDI U152.SDO
N$293
  Top 0.203: U154.CKI U153.CKO
N$294
  Top 0.203: U154.SDI U153.SDO
N$295
  Top 0.203: U148.SDI U147.SDO
N$296
  Top 0.203: U148.CKI U147.CKO
N$297
  Top 0.203: U156.SDI U155.SDO
N$298
  Top 0.203: U156.CKI U155.CKO
N$299
  Top 0.203: U157.CKI U156.CKO
N$300
  Top 0.203: U157.SDI U156.SDO
N$301
  Top 0.203: U158.SDI U157.SDO
N$302
  Top 0.203: U158.CKI U157.CKO
N$303
  Top 0.203: U159.CKI U158.CKO
N$304
  Top 0.203: U159.SDI U158.SDO
N$305
  Top 0.203: U160.CKI U159.CKO
N$306
  Top 0.203: U160.SDI U159.SDO
N$307
  Top 0.203: U161.CKI U160.CKO
N$308
  Top 0.203: U161.SDI U160.SDO
N$309
  Top 0.203: U163.SDI U162.SDO
N$310
  Top 0.203: U163.CKI U162.CKO
N$311
  Top 0.203: U164.CKI U163.CKO
N$312
  Top 0.203: U164.SDI U163.SDO
N$313
  Top 0.203: U164.SDO U165.SDI
N$314
  Top 0.203: U165.CKI U164.CKO
N$315
  Top 0.203: U165.CKO U166.CKI
N$316
  Top 0.203: U166.SDI U165.SDO
N$317
  Top 0.203: U166.CKO U167.CKI
N$318
  Top 0.203: U167.SDI U166.SDO
N$319
  Top 0.203: U167.CKO U168.CKI
N$320
  Top 0.203: U167.SDO U168.SDI
N$321
  Top 0.203: U162.SDI U161.SDO
N$322
  Top 0.203: U162.CKI U161.CKO
N$323
  Top 0.203: U155.SDI U154.SDO
N$324
  Top 0.203: U155.CKI U154.CKO
N$325
  Top 0.203: U169.SDO U170.SDI
N$326
  Top 0.203: U169.CKO U170.CKI
N$327
  Top 0.203: U170.CKO U171.CKI
N$328
  Top 0.203: U170.SDO U171.SDI
N$329  (via drill 0.3)
  Top 0.203: U172.SDI 135.53,50.23 134.05,50.23 v133.35,49.53 | v132.08,44.77 U171.SDO
  Bottom 0.203: v133.35,49.53 132.08,48.26 v132.08,44.77
N$330
  Top 0.203: U171.CKO 132.91,45.02 132.91,46.04 133.22,46.35 133.22,47.56 135.32,49.66 136.02,49.66 137.03,50.67 136.97,51.08 U172.CKI
N$331
  Top 0.203: U173.CKI U172.CKO
N$332
  Top 0.203: U173.SDI U172.SDO
N$333
  Top 0.203: U174.CKI U173.CKO
N$334
  Top 0.203: U174.SDI U173.SDO
N$335
  Top 0.203: U175.CKI U174.CKO
N$336
  Top 0.203: U175.SDI U174.SDO
N$337
  Top 0.203: U177.SDI U176.SDO
N$338
  Top 0.203: U177.CKI U176.CKO
N$339
  Top 0.203: U178.CKI U177.CKO
N$340
  Top 0.203: U178.SDI U177.SDO
N$341
  Top 0.203: U179.SDI U178.SDO
N$342
  Top 0.203: U179.CKI U178.CKO
N$343
  Top 0.203: U180.CKI U179.CKO
N$344
  Top 0.203: U180.SDI U179.SDO
N$345
  Top 0.203: U181.CKI U180.CKO
N$346
  Top 0.203: U181.SDI U180.SDO
N$347
  Top 0.203: U182.CKI U181.CKO
N$348
  Top 0.203: U182.SDI U181.SDO
N$349
  Top 0.203: U176.SDI U175.SDO
N$350
  Top 0.203: U176.CKI U175.CKO
N$351
  Top 0.203: U184.SDI U183.SDO
N$352
  Top 0.203: U184.CKI U183.CKO
N$353
  Top 0.203: U185.CKI U184.CKO
N$354
  Top 0.203: U185.SDI U184.SDO
N$355
  Top 0.203: U186.SDI U185.SDO
N$356
  Top 0.203: U186.CKI U185.CKO
N$357
  Top 0.203: U187.CKI U186.CKO
N$358
  Top 0.203: U187.SDI U186.SDO
N$359
  Top 0.203: U188.CKI U187.CKO
N$360
  Top 0.203: U188.SDI U187.SDO
N$361
  Top 0.203: U189.CKI U188.CKO
N$362
  Top 0.203: U189.SDI U188.SDO
N$365
  Top 0.203: U191.SDI U190.SDO
N$366
  Top 0.203: U191.CKI U190.CKO
N$367
  Top 0.203: U192.CKI U191.CKO
N$368
  Top 0.203: U192.SDI U191.SDO
N$369
  Top 0.203: U193.SDI U192.SDO
N$370
  Top 0.203: U193.CKI U192.CKO
N$371
  Top 0.203: U194.CKI U193.CKO
N$372
  Top 0.203: U194.SDI U193.SDO
N$373
  Top 0.203: U195.CKI U194.CKO
N$374
  Top 0.203: U195.SDI U194.SDO
N$375
  Top 0.203: U190.SDI U189.SDO
N$376
  Top 0.203: U190.CKI U189.CKO
N$377
  Top 0.203: U183.SDI U182.SDO
N$378
  Top 0.203: U183.CKI U182.CKO
N$379
  Top 0.203: U196.CKI U195.CKO
N$380
  Top 0.203: U196.SDI U195.SDO
N$381
  Top 0.203: U197.SDO U198.SDI
N$382
  Top 0.203: U197.CKO U198.CKI
N$383
  Top 0.203: U198.CKO U199.CKI
N$384
  Top 0.203: U198.SDO U199.SDI
N$385
  Top 0.203: U199.SDO U200.SDI
N$386
  Top 0.203: U199.CKO U200.CKI
N$387
  Top 0.203: U200.CKO U201.CKI
N$388
  Top 0.203: U200.SDO U201.SDI
N$389
  Top 0.203: U201.CKO U202.CKI
N$390
  Top 0.203: U201.SDO U202.SDI
N$391
  Top 0.203: U202.CKO U203.CKI
N$392
  Top 0.203: U202.SDO U203.SDI
N$393
  Top 0.203: U204.SDO U205.SDI
N$394
  Top 0.203: U204.CKO U205.CKI
N$395
  Top 0.203: U205.CKO U206.CKI
N$396
  Top 0.203: U205.SDO U206.SDI
N$397
  Top 0.203: U206.SDO U207.SDI
N$398
  Top 0.203: U206.CKO U207.CKI
N$399
  Top 0.203: U207.CKO 137.86,50.1 138.24,52.64 140.21,54.61 140.97,54.61 141.99,55.63 141.99,55.94 U208.CKI
N$400  (via drill 0.3)
  Top 0.203: U208.SDI 140.55,55.24 139.07,55.24 v138.43,54.61 | U207.SDO 136.97,48.77 v136.4,49.09
  Bottom 0.203: v138.43,54.61 136.91,53.09 v136.4,49.09
N$401
  Top 0.203: U209.CKI U208.CKO
N$402
  Top 0.203: U209.SDI U208.SDO
N$403
  Top 0.203: U210.CKI U209.CKO
N$404
  Top 0.203: U210.SDI U209.SDO
N$405
  Top 0.203: U203.SDO U204.SDI
N$406
  Top 0.203: U203.CKO U204.CKI
N$407
  Top 0.203: U212.SDI U211.SDO
N$408
  Top 0.203: U212.CKI U211.CKO
N$409
  Top 0.203: U213.CKI U212.CKO
N$410
  Top 0.203: U213.SDI U212.SDO
N$411
  Top 0.203: U214.SDI U213.SDO
N$412
  Top 0.203: U214.CKI U213.CKO
N$413
  Top 0.203: U215.CKI U214.CKO
N$414
  Top 0.203: U215.SDI U214.SDO
N$415
  Top 0.203: U216.CKI U215.CKO
N$416
  Top 0.203: U216.SDI U215.SDO
N$417
  Top 0.203: U217.CKI U216.CKO
N$418
  Top 0.203: U217.SDI U216.SDO
N$419
  Top 0.203: U218.SDI U217.SDO
N$420
  Top 0.203: U218.CKI U217.CKO
N$421
  Top 0.203: U211.SDI U210.SDO
N$422
  Top 0.203: U211.CKI U210.CKO
N$423
  Top 0.203: U219.CKI U218.CKO
N$424
  Top 0.203: U219.SDI U218.SDO
N$425
  Top 0.203: U220.CKI U219.CKO
N$426
  Top 0.203: U220.SDI U219.SDO
N$427
  Top 0.203: U220.SDO U221.SDI
N$428
  Top 0.203: U221.CKI U220.CKO
N$429
  Top 0.203: U221.CKO U222.CKI
N$430
  Top 0.203: U222.SDI U221.SDO
N$431
  Top 0.203: U223.CKI U222.CKO
N$432
  Top 0.203: U223.SDI U222.SDO
N$433
  Top 0.203: U224.CKI U223.CKO
N$434
  Top 0.203: U224.SDI U223.SDO
N$435
  Top 0.203: U226.SDI U225.SDO
N$436
  Top 0.203: U226.CKI U225.CKO
N$437
  Top 0.203: U227.CKI U226.CKO
N$438
  Top 0.203: U227.SDI U226.SDO
N$439
  Top 0.203: U228.SDI U227.SDO
N$440
  Top 0.203: U228.CKI U227.CKO
N$441
  Top 0.203: U229.CKI U228.CKO
N$442
  Top 0.203: U229.SDI U228.SDO
N$443
  Top 0.203: U229.CKO U230.CKI
N$444
  Top 0.203: U229.SDO U230.SDI
N$445
  Top 0.203: U231.CKI U230.CKO
N$446
  Top 0.203: U231.SDI U230.SDO
N$447
  Top 0.203: U233.SDI U232.SDO
N$448
  Top 0.203: U233.CKI U232.CKO
N$449
  Top 0.203: U234.CKI U233.CKO
N$450
  Top 0.203: U234.SDI U233.SDO
N$451
  Top 0.203: U235.SDI U234.SDO
N$452
  Top 0.203: U235.CKI U234.CKO
N$453
  Top 0.203: U236.CKI U235.CKO
N$454
  Top 0.203: U236.SDI U235.SDO
N$455
  Top 0.203: U237.CKI U236.CKO
N$456
  Top 0.203: U237.SDI U236.SDO
N$457
  Top 0.203: U238.CKI U237.CKO
N$458
  Top 0.203: U238.SDI U237.SDO
N$459
  Top 0.203: U232.SDI U231.SDO
N$460
  Top 0.203: U232.CKI U231.CKO
N$461
  Top 0.203: U240.SDI U239.SDO
N$462
  Top 0.203: U240.CKI U239.CKO
N$463
  Top 0.203: U241.CKI U240.CKO
N$464
  Top 0.203: U241.SDI U240.SDO
N$465
  Top 0.203: U242.SDI U241.SDO
N$466
  Top 0.203: U242.CKI U241.CKO
N$467
  Top 0.203: U243.CKI U242.CKO
N$468
  Top 0.203: U243.SDI U242.SDO
N$469
  Top 0.203: U244.CKI U243.CKO
N$470
  Top 0.203: U244.SDI U243.SDO
N$471
  Top 0.203: U245.CKI U244.CKO
N$472
  Top 0.203: U245.SDI U244.SDO
N$473
  Top 0.203: U246.SDI U245.SDO
N$474
  Top 0.203: U246.CKI U245.CKO
N$475
  Top 0.203: U239.SDI U238.SDO
N$476
  Top 0.203: U239.CKI U238.CKO
N$477
  Top 0.203: U247.CKI U246.CKO
N$478
  Top 0.203: U247.SDI U246.SDO
N$479
  Top 0.203: U248.CKI U247.CKO
N$480
  Top 0.203: U248.SDI U247.SDO
N$481
  Top 0.203: U249.SDI U248.SDO
N$482
  Top 0.203: U249.CKI U248.CKO
N$483
  Top 0.203: U250.CKI U249.CKO
N$484
  Top 0.203: U250.SDI U249.SDO
N$485
  Top 0.203: U251.CKI U250.CKO
N$486
  Top 0.203: U251.SDI U250.SDO
N$487
  Top 0.203: U252.CKI U251.CKO
N$488
  Top 0.203: U252.SDI U251.SDO
N$489  (via drill 0.3)
  Top 0.203: v118.75,33.02 118.75,36.58 117.03,38.29 116.71,38.61 115.84,38.61 U127.CKI
  Bottom 0.203: J1.4 150.73,32.79 151.13,32.38 151.13,31.75 149.07,29.69 arc-28 143.51,15.24 140.97,12.7 138.43,12.7 118.75,32.38 v118.75,33.02
N$490  (via drill 0.25 pad 0.51)
  Top 0.203: U1.CKI 35.49,31.56 v35.05,32
  Bottom 0.203: v35.05,32 35.05,36.83 16.76,55.12 arc45 8.89,36.07 8.61,35.79 J2.4
SD1
  Top 0.203: U29.SDI U28.SDO
SD2
  Top 0.203: U57.SDI U56.SDO
SD3
  Top 0.203: U85.SDI U84.SDO
SD4
  Top 0.203: U113.SDI U112.SDO
SD5
  Top 0.203: U141.SDI U140.SDO
SD6
  Top 0.203: U168.SDO U169.SDI
SD7
  Top 0.203: U197.SDI U196.SDO
SD8
  Top 0.203: U225.SDI U224.SDO
VCC  (via drill 0.25 pad 0.51)
  Top 0.152: v39.37,45.72 U19.VDD | v43.74,44.85 U18.VDD | v35,44.85 U20.VDD | v31.29,42.37 U5.VDD | v28.81,38.66 U6.VDD | v27.94,34.29 U7.VDD | v28.81,29.92 U8.VDD | v31.29,26.21 U9.VDD | v36.5,31.42 U1.VDD | v42.24,31.42 U2.VDD | v42.24,37.16 U3.VDD | v36.5,37.16 U4.VDD | v35,23.73 U10.VDD | v39.37,22.86 U11.VDD | v47.47,26.16 47.76,25.86 47.85,25.79 U13.VDD | v49.93,29.92 U14.VDD | v50.8,34.29 U15.VDD | v49.93,38.66 U16.VDD | v47.45,42.37 U17.VDD | v51.55,48.1 U40.VDD | v43.39,52.26 U42.VDD | v34.23,51.97 U44.VDD | v47.73,50.7 U41.VDD | v30,50.14 U45.VDD | v26.35,47.31 U21.VDD | v23.52,43.66 U22.VDD | v21.69,39.43 U23.VDD | v20.96,34.87 U24.VDD | v21.4,30.27 U25.VDD | v22.96,25.93 U26.VDD | v25.56,22.11 U27.VDD | v29.02,19.06 U28.VDD | v33.13,16.96 U29.VDD | v37.64,15.96 U30.VDD | v42.25,16.1 U31.VDD | v46.68,17.39 U32.VDD | v50.66,19.74 U33.VDD | v53.92,23 U34.VDD | v56.27,26.98 U35.VDD | v57.56,31.41 U36.VDD | v56.7,40.53 U38.VDD | v54.6,44.64 U39.VDD | v57.33,52.25 U73.VDD | v53.94,55.1 U74.VDD | v50.1,57.31 U75.VDD | v45.94,58.83 U76.VDD | v41.58,59.59 U77.VDD | v37.16,59.59 U78.VDD | v32.8,58.83 U79.VDD | v28.63,57.31 U80.VDD | v24.8,55.1 U81.VDD | v21.41,52.25 U46.VDD | v18.56,48.86 U47.VDD | v16.35,45.02 U48.VDD | v14.84,40.86 U49.VDD | v14.07,36.5 U50.VDD | v14.07,32.08 U51.VDD | v14.84,27.72 U52.VDD | v16.35,23.55 U53.VDD | v18.56,19.72 U54.VDD | v21.41,16.33 U55.VDD | v24.8,13.48 U56.VDD | v28.63,11.27 U57.VDD | v32.8,9.76 U58.VDD | v37.16,8.99 U59.VDD | v41.58,8.99 U60.VDD | v50.1,11.27 U62.VDD | v45.94,9.76 U61.VDD | v53.94,13.48 U63.VDD | v57.37,16.3 57.39,16.27 U64.VDD | v60.18,19.72 U65.VDD | v63.91,27.72 U67.VDD | v64.67,32.08 U68.VDD | v64.67,36.5 U69.VDD | v63.91,40.86 U70.VDD | v62.39,45.02 U71.VDD
  Top 0.152: v60.18,48.86 U72.VDD | v61.46,57.98 U116.VDD | v57.95,60.82 U117.VDD | v54.07,63.15 U118.VDD | v49.91,64.91 U119.VDD | v45.55,66.08 U120.VDD | v41.06,66.63 U121.VDD | v36.55,66.55 U122.VDD | U123.VDD v32.09,65.84 | U124.VDD v27.76,64.52 | U125.VDD v23.67,62.62 | U126.VDD v19.88,60.15 | U82.VDD v16.47,57.19 | U83.VDD v13.51,53.78 | U84.VDD v11.04,49.99 | U85.VDD v9.14,45.9 | U86.VDD v7.81,41.58 | U87.VDD v7.11,37.11 | v5.59,32.37 6.05,32.57 U88.VDD | v151.78,37.31 U248.VDD | v7.58,28.11 U89.VDD | v8.75,23.75 U90.VDD | v12.84,15.71 U92.VDD | v15.69,12.2 U93.VDD | v18.99,9.12 U94.VDD | v22.69,6.53 U95.VDD | v26.72,4.48 U96.VDD | v30.99,3.01 U97.VDD | v35.42,2.15 U98.VDD | v39.93,1.91 U99.VDD | v44.44,2.3 U100.VDD | v53.06,4.94 U102.VDD | v60.62,9.85 U104.VDD | v63.81,13.04 U105.VDD | v68.72,20.6 U107.VDD | v71.36,29.22 U109.VDD | U108.VDD v70.34,24.82 | v71.75,33.73 U110.VDD | U111.VDD 72.04,38.24 v71.51,38.24 | v69.18,46.94 U113.VDD | v70.65,42.67 U112.VDD | v67.13,50.97 U114.VDD | v64.54,54.67 U115.VDD | v85.97,38.24 U224.VDD | v85.73,33.73 U225.VDD | v86.12,29.22 U226.VDD | v86.83,42.67 U223.VDD | v88.3,46.94 U222.VDD | v90.35,50.97 U221.VDD | v92.94,54.67 U220.VDD | v96.02,57.98 U219.VDD | v99.53,60.82 U218.VDD | v103.41,63.15 U217.VDD | v107.57,64.91 U216.VDD | v111.93,66.08 U215.VDD | v116.41,66.63 U214.VDD | v120.93,66.55 U213.VDD | v125.39,65.84 U212.VDD | v129.72,64.52 U211.VDD | v133.81,62.62 U210.VDD | v137.6,60.15 U209.VDD | v141.01,57.19 U208.VDD | v143.97,53.78 U252.VDD | v146.44,49.99 U251.VDD | v148.34,45.9 U250.VDD | v149.67,41.58 U249.VDD | v151.72,32.59 U247.VDD | U245.VDD v148.73,23.75 | U244.VDD v146.97,19.59 | U243.VDD v144.64,15.71 | U242.VDD v141.8,12.2 | U241.VDD v138.49,9.12
  Top 0.152: U240.VDD v134.79,6.53 | U239.VDD v130.76,4.48 | U238.VDD v126.49,3.01 | U237.VDD v122.06,2.15 | U236.VDD v117.55,1.91 | U235.VDD v113.04,2.3 | U234.VDD v108.64,3.32 | U233.VDD v104.42,4.94 | U232.VDD v100.47,7.13 | U231.VDD v96.86,9.85 | U230.VDD v93.67,13.04 | U229.VDD v90.95,16.65 | U228.VDD v88.76,20.6 | U227.VDD v87.14,24.82 | v100.15,52.25 U181.VDD | v97.3,48.86 U182.VDD | v95.09,45.02 U183.VDD | v92.81,36.5 U185.VDD | v92.81,32.08 U186.VDD | v93.58,27.72 U187.VDD | U189.VDD v97.3,19.72 | v95.09,23.55 U188.VDD | v101.21,26.98 U158.VDD | v103.56,23 U159.VDD | v103.54,13.48 U191.VDD | U199.VDD v136.07,16.33
  Top 0.203: U203.VDD v143.41,32.08 | U169.VDD v136.52,34.74 | U170.VDD v135.83,39.3 | v128.73,38.7 129.19,38.89 U146.VDD | U145.VDD v129.65,34.29 | v128.73,29.89 U144.VDD | U167.VDD v134.52,25.93 | U168.VDD v136.08,30.27 | U202.VDD v142.65,27.72 | U204.VDD v143.41,36.5 | U246.VDD v149.9,28.11 | U201.VDD v141.13,23.55 | U200.VDD v138.92,19.72 | U166.VDD v131.92,22.11 | U205.VDD v142.65,40.86 | U206.VDD v141.13,45.02 | U207.VDD v138.92,48.86 | U171.VDD v134.03,43.55 | U147.VDD v131.13,47.31 | U148.VDD v127.48,50.14 | U149.VDD v123.25,51.97 | U150.VDD v118.69,52.7 | U151.VDD v114.09,52.26 | U152.VDD v109.75,50.7 | U153.VDD v105.93,48.1 | U154.VDD v102.88,44.64 | v109.94,42.45 U135.VDD | v113.7,44.94 U134.VDD | v118.1,45.78 118.1,46.3 U133.VDD | v122.55,44.91 122.71,45.31 U132.VDD | U155.VDD v100.78,40.53 | U156.VDD v99.78,36.02 | U157.VDD v99.92,31.41 | U137.VDD v106.6,34.29 | v107.51,38.68 U136.VDD | v107.56,29.93 107.01,29.7 U138.VDD | U127.VDD v115.24,37.16 | U128.VDD v115.24,31.42 | v113.74,23.7 113.53,23.2 U140.VDD | v118.1,22.82 118.1,22.28 U141.VDD | v122.51,23.68 U142.VDD | U160.VDD v106.82,19.74 | U161.VDD v110.8,17.39 | U162.VDD v115.23,16.1 | U163.VDD v119.84,15.96 | U164.VDD v124.35,16.96 | U165.VDD v128.46,19.06 | v100.15,16.33 U190.VDD | U192.VDD v107.38,11.27 | U193.VDD v111.54,9.76 | U194.VDD v115.9,8.99 | U195.VDD v120.32,8.99 | U196.VDD v124.68,9.76 | U197.VDD v128.84,11.27 | U198.VDD v132.68,13.48 | v109.98,26.14 109.97,26.15 U139.VDD | v120.98,37.16 U130.VDD | v120.98,31.42 U129.VDD | v126.23,42.41 U131.VDD | U143.VDD 126.58,25.79 126.24,26.12 v126.24,26.14 | v93.58,40.86 U184.VDD | v103.54,55.1 U180.VDD | v107.38,57.31 U179.VDD | v111.54,58.83 U178.VDD | v115.9,59.59 U177.VDD
  Top 0.203: v120.32,59.59 U176.VDD | v124.68,58.83 U175.VDD | v128.84,57.31 U174.VDD | v132.68,55.1 U173.VDD | v136.07,52.25 U172.VDD | U12.VDD v43.74,23.73 | v38.79,52.7 U43.VDD | v62.39,23.55 U66.VDD | U91.VDD v10.52,19.59 | U37.VDD v57.7,36.02 | U106.VDD v66.53,16.65 | U101.VDD v48.84,3.32 | U103.VDD v57.01,7.13
  pour Bottom: 157.48,0 157.48,69.85 0,69.85 0,0

## Text on the board
Dimension: Route out | Route out | Route out | Route out | Route out | Route out | Route out | Route out | Route out | Route out | Route out | Route out | Route out | Route out | Route out | Route out | Route out | Route out | Route out | Route out | Route out | Route out | Route out | Route out | Route out | Route out | Route out | Route out | Route out | Route out | Route out | Route out